# Altium project DATN.PrjPcb
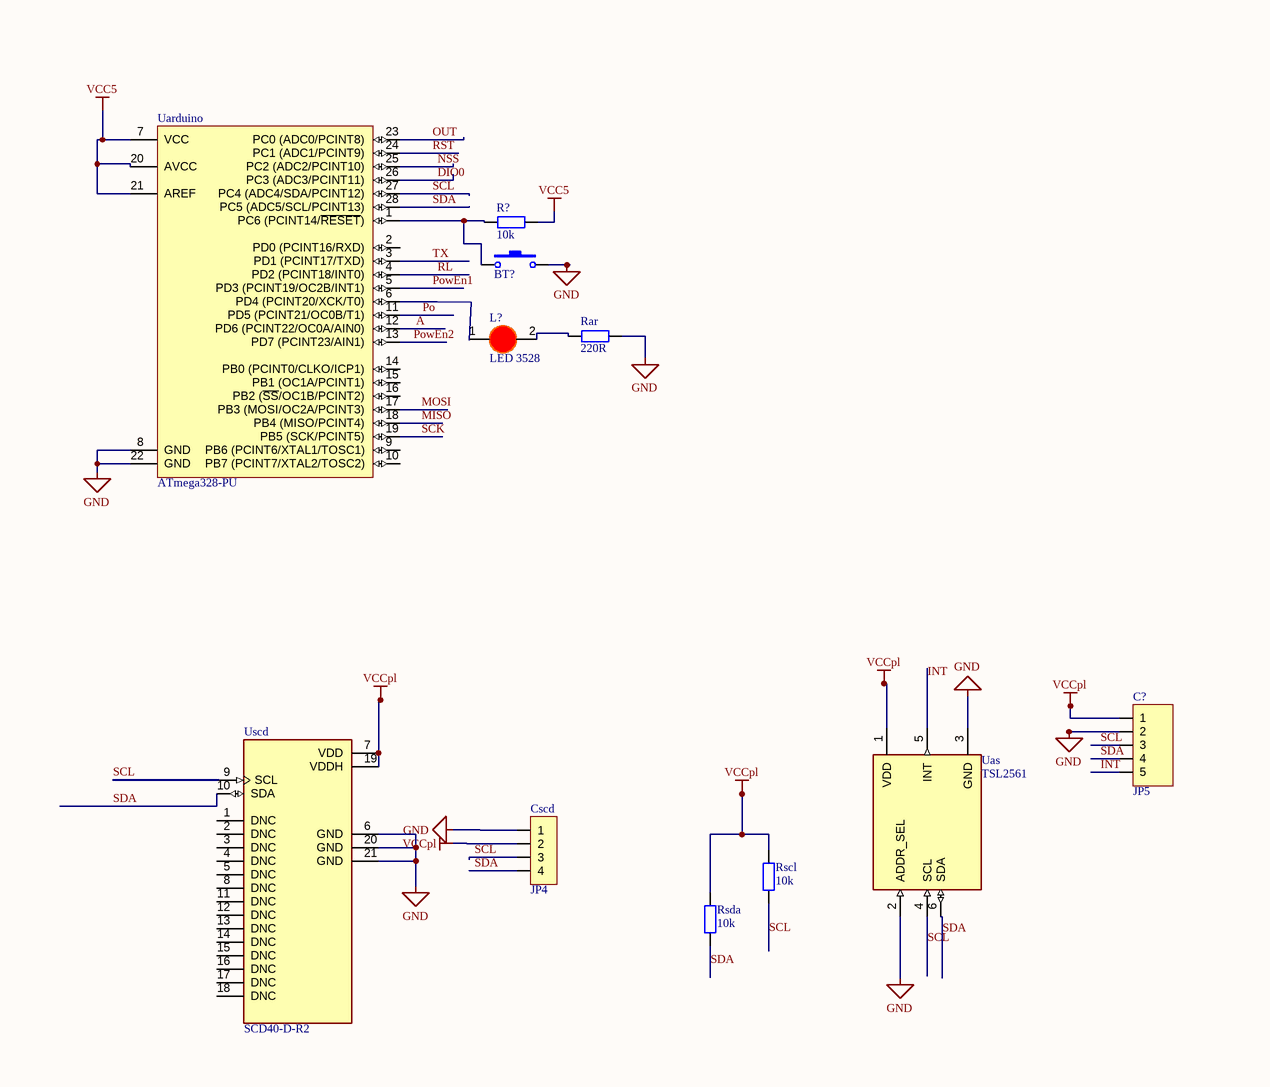
[diagram p0: Sheet1.SchDoc, top left]
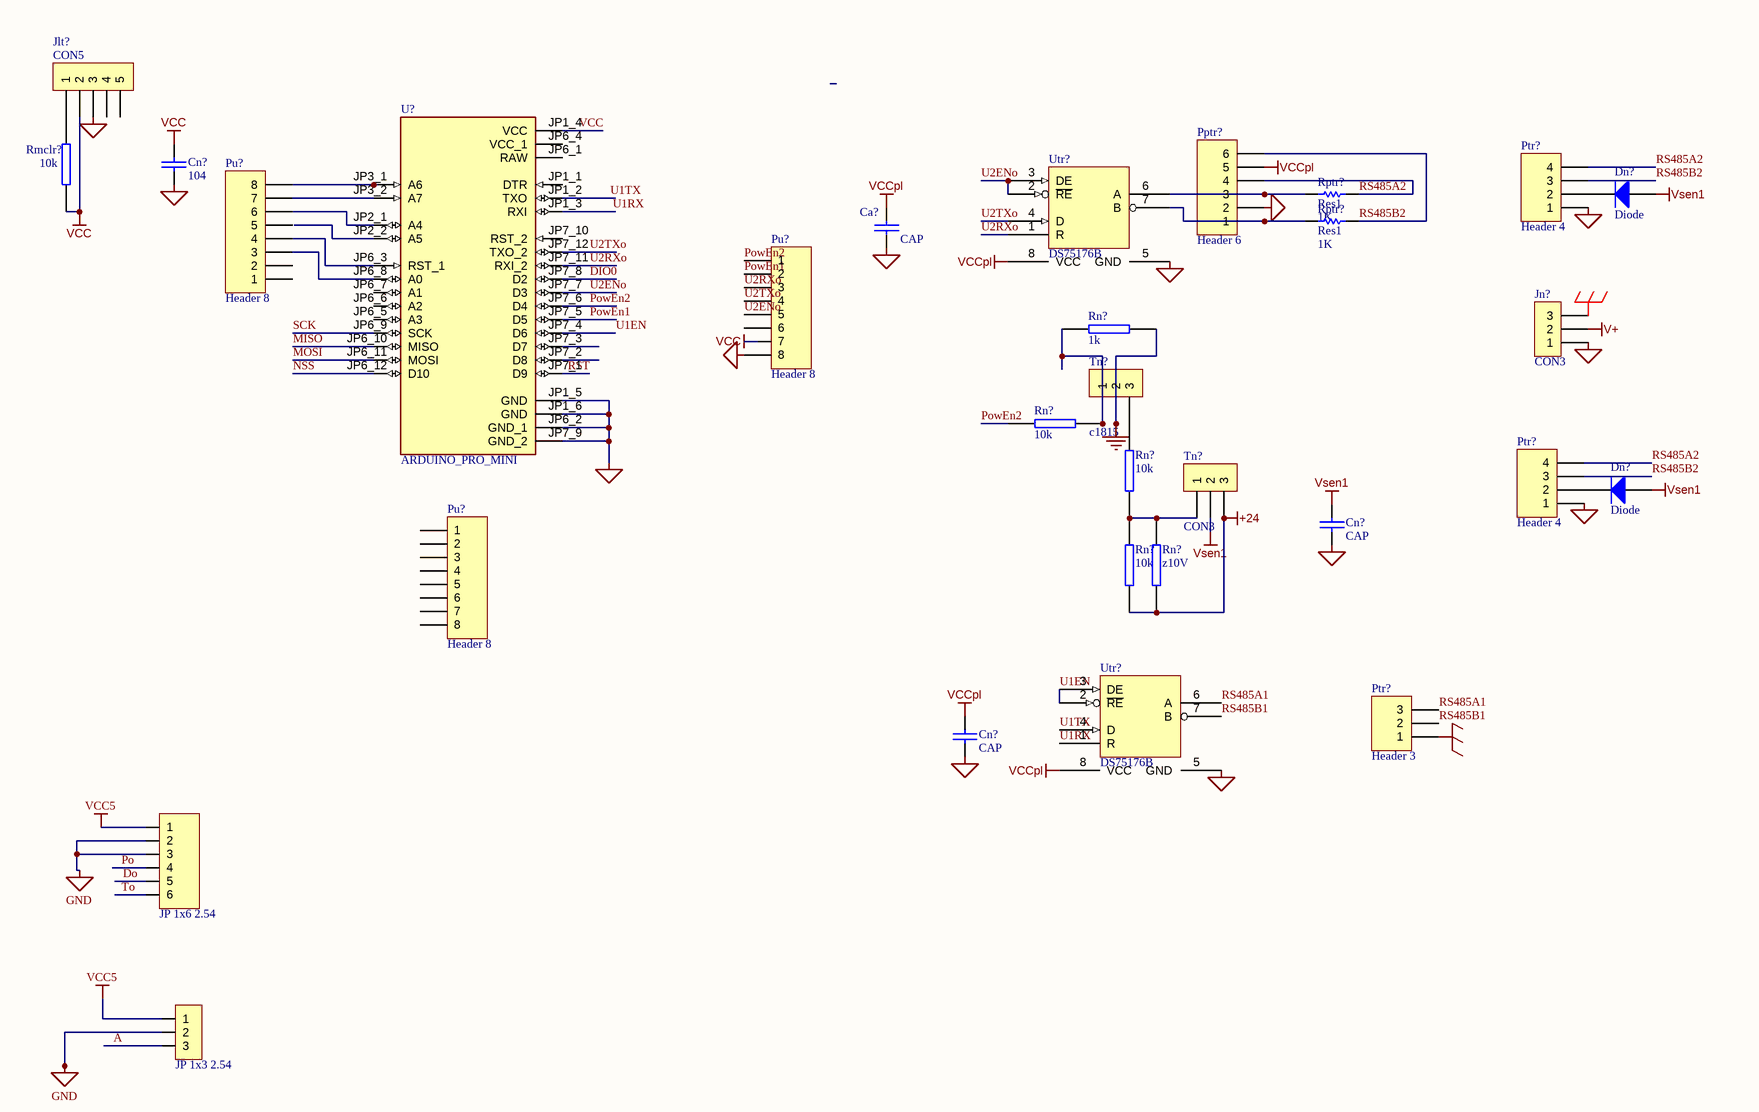
[diagram p1: Sheet1.SchDoc, top right]
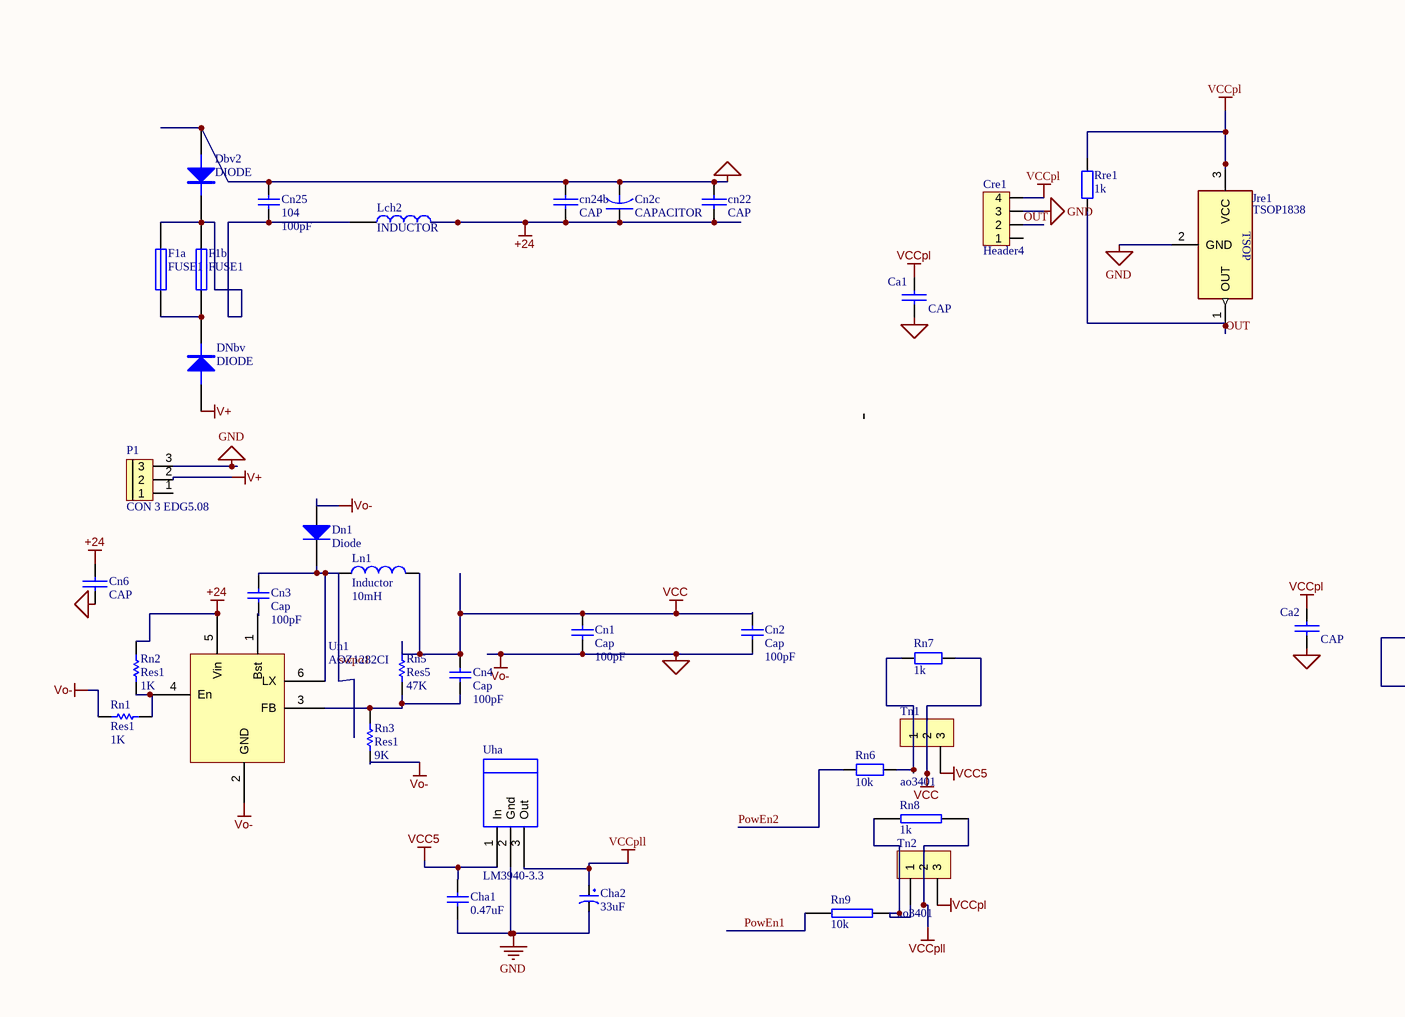
[diagram p2: Sheet1.SchDoc, bottom left]
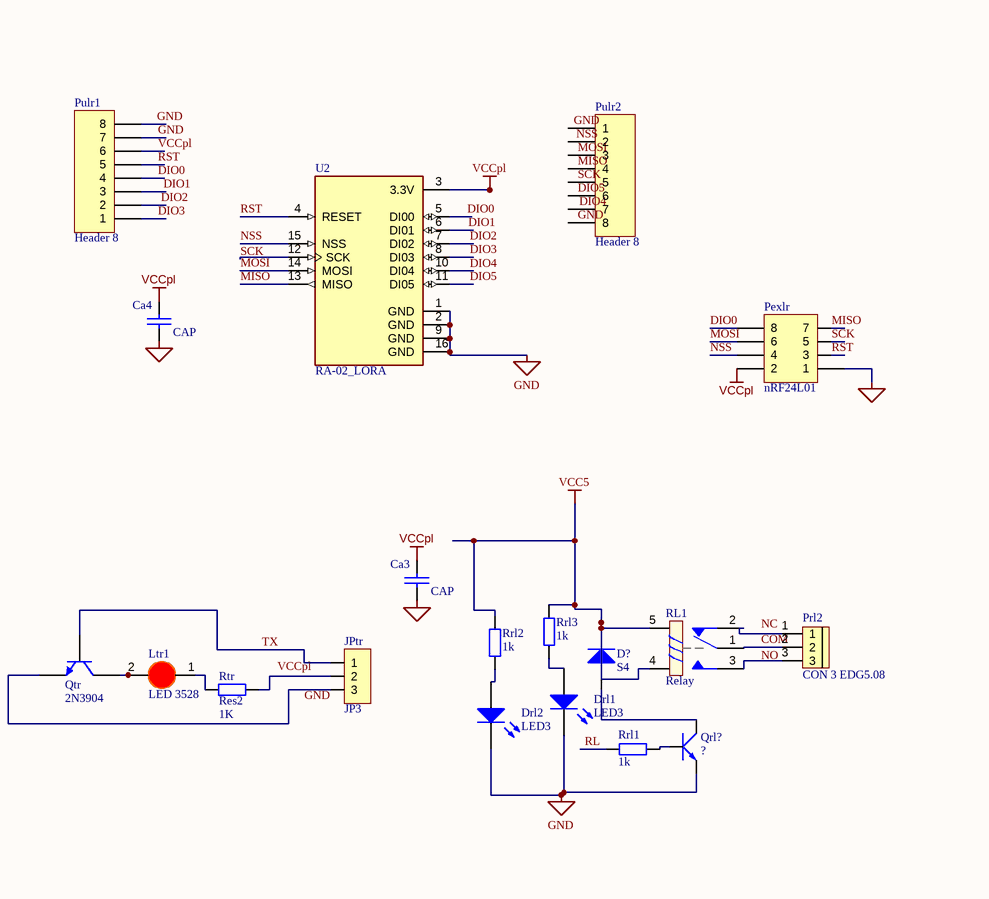
[diagram p3: Sheet1.SchDoc, bottom right]
1 sheet, 96 parts. Net scope: global (net labels, ports and power ports of the same name join across sheets).
Board file: PCB1.PcbDoc

## Sheet Sheet1.SchDoc
size 594 x 420 mm; SheetNumber: 1; SheetTotal: 1; SPICEModelCacheKOELNJHK: <root> / <DocumentId>KOELNJHK</DocumentId> / <CacheFrame Number="0"> / <Model Name="diode" Kind="MDL"> / <Text>*Default Diode / *Diode Pinout: A,K / .MODEL DIODE D()</Text> / </Model> / </CacheFrame> / </root>

### Parts
(Parts that share a designator on the sheet are numbered #1, #2 ... from top to bottom, then left to right.)
BT?  Nut Nhan 2 Chan SMD 3x6x2.5  [Nut Nhan 2 Chan SMD 3x6x2.5]  (value not drawn)
C?  JP5  [JP5-C1T]
Ca1  CAP  [0805]
Ca2  CAP  [0805]
Ca3  CAP  [0805]
Ca4  CAP  [0805]
Ca?  CAP  [0805]
Cha1  0.47uF  [tu tantalum dip5.08]
Cha2  33uF  [tu tantalum smd3216]
Cn1  Cap  value 100pF  [RAD-0.3]
Cn2  Cap  value 100pF  [RAD-0.3]
Cn2c  CAPACITOR  [cc15r15]
Cn3  Cap  value 100pF  [RAD-0.3]
Cn4  Cap  value 100pF  [RAD-0.3]
Cn6  CAP  [1206e]
cn22  CAP  [C4006]
cn24b  CAP  [1206e]
Cn25  104  value 100pF  [0805c]
Cn?#1  104  [0805]
Cn?#2  CAP  [1206e]
Cn?#3  CAP  [0805]
Cre1  Header4  [HDR4]
Cscd  JP4  [JP4-C1T]
D?  S4  [DIODE SOD-123]
Dbv2  DIODE  [smb]
Dn1  Diode  [SMC]
Dn?#1  Diode  [Sma]
Dn?#2  Diode  [Sma]
DNbv  DIODE  [sma]
Drl1  LED3  [3.5X2.8X1.9]
Drl2  LED3  [3.5X2.8X1.9]
F1a  FUSE1  [2010e]
F1b  FUSE1  [FuseSMD050]
Jlt?  CON5  [sip5]
Jn?  CON3  [giacdung3]
JP?#1  JP 1x6 2.54  [JP 1x6 CT]
JP?#2  JP 1x3 2.54  [JP 1x3 DT]
JPtr  JP3  [JP3-C1T]
Jre1  TSOP1838  [TSOP1838]
L?  LED 3528  [LED-3528-RED]
Lch2  INDUCTOR  [IND_SPR05x]
Ln1  Inductor  value 10mH  [0402-A]
Ltr1  LED 3528  [LED-3528-RED]
P1  CON 3 EDG5.08  [CON 3 3EDG5.08]
Pexlr  nRF24L01  [HDR2X4]
Pptr?  Header 6  [sot23-6]
Prl2  CON 3 EDG5.08  [CON 3 3EDG5.08]
Ptr?#1  Header 4  [giacdung4]
Ptr?#2  Header 4  [giacdung4]
Ptr?#3  Header 3  [giacdung3]
Pu?#1  Header 8  [HDR1X8]
Pu?#2  Header 8  [HDR1X8]
Pu?#3  Header 8  [HDR1X8]
Pulr1  Header 8  [HDR1X8]
Pulr2  Header 8  [HDR1X8]
Qrl?  ?  [TO92]
Qtr  2N3904  [TO-92A]
R?  10k  [tro vach 2w]
Rar  220R  [tro vach 2w]
RL1  Relay  [Relay 5 Chan SRD]
Rmclr?  10k  [0805c]
Rn1  Res1  value 1K  [AXIAL-0.3]
Rn2  Res1  value 1K  [AXIAL-0.3]
Rn3  Res1  value 9K  [AXIAL-0.3]
Rn5  Res5  value 47K  [AXIAL-0.3]
Rn6  10k  [tro vach 1w]
Rn7  1k  [tro vach 2w]
Rn8  1k  [0805c]
Rn9  10k  [0805c]
Rn?#1  1k  [0805c]
Rn?#2  10k  [0805c]
Rn?#3  10k  [0805c]
Rn?#4  10k  [0805c]
Rn?#5  z10V  [1206]
Rptr?#1  Res1  value 1K  [0805c]
Rptr?#2  Res1  value 1K  [0805c]
Rre1  1k  [tro vach 2w]
Rrl1  1k  [tro vach 2w]
Rrl2  1k  [tro vach 2w]
Rrl3  1k  [tro vach 2w]
Rscl  10k  [tro smd 2512]
Rsda  10k  [tro smd 2512]
Rtr  Res2  value 1K  [AXIAL-0.4]
Tn1  ao3401  [sot23-3]
Tn2  ao3401  [sot23-3]
Tn?#1  c1815  [sot23-3]
Tn?#2  CON3  [dpak]
U2  RA-02_LORA  [MODULE_RA-02_LORA]
U?  ARDUINO_PRO_MINI  [MODULE_ARDUINO_PRO_MINI]
Uarduino  ATmega328-PU  [DIP28]
Uas  TSL2561  [XDCR_TSL2561]
Uha  LM3940-3.3  [SOT223]
Un1  AOZ1282CI  [Sot23-6]
Uscd  SCD40-D-R2  [XDCR_SCD40-D-R2]
Utr?#1  DS75176B  [so-8]
Utr?#2  DS75176B  [so-8]

### Nets
+24: Cn2c.1 Cn6.1 cn22.1 cn24b.1 Lch2.2 Rn2.2 Rn?#4.1 Rn?#5.1 Tn?#2.3 Un1.5(Vin)
EARTH: Jn?.3 Ptr?#3.1
GND: BT?.2 C?.2 Ca1.2 Ca2.2 Ca3.2 Ca4.2 Ca?.2 Cha1.2 Cha2.2 Cn1.1 Cn2.1 Cn2c.2 Cn6.2 cn22.2 cn24b.2 Cn25.2 Cn?#1.2 Cn?#2.2 Cn?#3.2 Cre1.3 Cscd.1 Dbv2.1(A) Dn1.1(A) Drl1.2(K) Drl2.2(K) Jlt?.3 Jn?.1 JP?#1.2 JP?#1.3 JP?#2.2 Jre1.2(GND) P1.3 Pexlr.1 Pptr?.2 Ptr?#1.1 Ptr?#2.1 Pu?#1.8 Pulr1.7 Pulr1.8 Qrl?.1(E) Rar.2 Rn1.1 Rn3.1 Rn?#1.2 Tn?#1.2 U2.1(GND) U2.2(GND) U2.9(GND) U2.16(GND) U?.JP1_5(GND) U?.JP1_6(GND) U?.JP6_2(GND_1) U?.JP7_9(GND_2) Uarduino.8(GND) Uarduino.22(GND) Uas.2(ADDR_SEL) Uas.3(GND) Uha.2(Gnd) Un1.2(GND) Uscd.6(GND) Uscd.20(GND) Uscd.21(GND) Utr?#1.5(GND) Utr?#2.5(GND)  [also labelled Vo-]
V+: DNbv.1(A) Jn?.2 P1.2
VCC: C?.1 Ca1.1 Ca2.1 Ca3.1 Ca4.1 Ca?.1 Cn1.2 Cn2.2 Cn4.2 Cn?#1.1 Cn?#3.1 Cre1.4 Cscd.2 Jlt?.2 Jre1.3(VCC) Pexlr.2 Pptr?.5 Pu?#1.7 Pulr1.6 Rmclr?.1 Rn5.2 Rn7.2 Rre1.2 Rscl.2 Rsda.2 Tn1.2 Tn2.3 U2.3(3.3V) U?.JP1_4(VCC) Uas.1(VDD) Uscd.7(VDD) Uscd.19(VDDH) Utr?#1.8(VCC) Utr?#2.8(VCC)  [also labelled VCCpl]
VCC5: Cha1.1 D?.2(K) JP?#1.1 JP?#2.1 R?.2 RL1.4 RL1.5 Rrl2.2 Rrl3.2 Tn1.3 Uarduino.7(VCC) Uarduino.20(AVCC) Uarduino.21(AREF) Uha.1(In)
VCCpll: Cha2.1 Rn8.2 Tn2.2 Uha.3(Out)
Vsen1: Cn?#2.1 Dn?#1.1(A) Dn?#2.1(A) Tn?#2.2
A: JP?#2.3 Uarduino.12(PD6_(PCINT22/OC0A/AIN0))
COM: Prl2.2 RL1.1
DIO0: Pexlr.8 Pulr1.4 U2.5(DI00) U?.JP7_8(D2) Uarduino.26(PC3_(ADC3/PCINT11))
DIO1: Pulr1.3 U2.6(DI01)
DIO2: Pulr1.2 U2.7(DI02)
DIO3: Pulr1.1 U2.8(DI03)
DIO4: U2.10(DI04)
DIO5: U2.11(DI05)
Do: JP?#1.5
INT: C?.5 Uas.5(INT)
MISO: Pexlr.7 U2.13(MISO) U?.JP6_10(MISO) Uarduino.18(PB4_(MISO/PCINT4))
MOSI: Pexlr.6 U2.14(MOSI) U?.JP6_11(MOSI) Uarduino.17(PB3_(MOSI/OC2A/PCINT3))
NSS: Pexlr.4 U2.15(NSS) U?.JP6_12(D10) Uarduino.25(PC2_(ADC2/PCINT10))
OUT: Cre1.2 Jre1.1(OUT) Rre1.1 Uarduino.23(PC0_(ADC0/PCINT8))
Po: JP?#1.4 Uarduino.11(PD5_(PCINT21/OC0B/T1))
PowEn1: Pu?#1.2 Rn9.1 U?.JP7_5(D5) Uarduino.5(PD3_(PCINT19/OC2B/INT1))
PowEn2: Pu?#1.1 Rn6.1 Rn?#2.1 U?.JP7_6(D4) Uarduino.13(PD7_(PCINT23/AIN1))
RL: Rrl1.1 Uarduino.4(PD2_(PCINT18/INT0))
RS485A1: Ptr?#3.3 Utr?#2.6(A)
RS485A2: Pptr?.4 Ptr?#1.4 Ptr?#2.4 Rptr?#1.1
RS485B1: Ptr?#3.2 Utr?#2.7(B)
RS485B2: Pptr?.6 Ptr?#1.3 Ptr?#2.3 Rptr?#2.1
RST: Pexlr.3 Pulr1.5 U2.4(RESET) U?.JP7_1(D9) Uarduino.24(PC1_(ADC1/PCINT9))
SCK: Pexlr.5 U2.12(SCK) U?.JP6_9(SCK) Uarduino.19(PB5_(SCK/PCINT5))
SCL: C?.3 Cscd.3 Rscl.1 Uarduino.27(PC4_(ADC4/SDA/PCINT12)) Uas.4(SCL) Uscd.9(SCL)
SDA: C?.4 Cscd.4 Rsda.1 Uarduino.28(PC5_(ADC5/SCL/PCINT13)) Uas.6(SDA) Uscd.10(SDA)
swpo1: Cn3.2 Dn1.2(K) Ln1.1 Un1.6(LX)
To: JP?#1.6
TX: JPtr.1 Qtr.2(B) Uarduino.3(PD1_(PCINT17/TXD))
U1EN: U?.JP7_4(D6) Utr?#2.2(~{RE}) Utr?#2.3(DE)
U1RX: U?.JP1_3(RXI) Utr?#2.1(R)
U1TX: U?.JP1_2(TXO) Utr?#2.4(D)
U2ENo: Pu?#1.5 U?.JP7_7(D3) Utr?#1.2(~{RE}) Utr?#1.3(DE)
U2RXo: Pu?#1.3 U?.JP7_11(RXI_2) Utr?#1.1(R)
U2TXo: Pu?#1.4 U?.JP7_12(TXO_2) Utr?#1.4(D)
NetBT?_1: BT?.1 R?.1 Uarduino.1(PC6_(PCINT14/~{RESET}))
NetCn3_1: Cn3.1 Un1.1(Bst)
NetCn4_1: Cn4.1 Rn3.2 Rn5.1 Un1.3(FB)
NetCn25_1: Cn25.1 Dbv2.2(K) F1a.2 F1b.2 Lch2.1
NetD?_1: D?.1(A) Qrl?.3(C)
NetDn?#1_2: Dn?#1.2(K) Ptr?#1.2
NetDn?#2_2: Dn?#2.2(K) Ptr?#2.2
NetDNbv_2: DNbv.2(K) F1a.1 F1b.1
NetDrl1_1: Drl1.1(A) Rrl3.1
NetDrl2_1: Drl2.1(A) Rrl2.1
NetJlt?_1: Jlt?.1 Rmclr?.2
NetJPtr_2: JPtr.2 Rtr.2
NetJPtr_3: JPtr.3 Qtr.1(E)
NetL?_1: L?.1(A) Uarduino.6(PD4_(PCINT20/XCK/T0))
NetL?_2: L?.2(K) Rar.1
NetLtr1_1: Ltr1.1(A) Rtr.1
NetLtr1_2: Ltr1.2(K) Qtr.3(C)
NetPptr?_1: Pptr?.1 Rptr?#2.2 Utr?#1.7(B)
NetPptr?_3: Pptr?.3 Rptr?#1.2 Utr?#1.6(A)
NetPrl2_1: Prl2.1 RL1.2
NetPrl2_3: Prl2.3 RL1.3
NetPu?#2_3: Pu?#2.3 U?.JP6_8(A0)
NetPu?#2_4: Pu?#2.4 U?.JP6_3(RST_1)
NetPu?#2_6: Pu?#2.6 U?.JP2_1(A4)
NetPu?#2_7: Pu?#2.7 U?.JP3_2(A7)
NetPu?#2_8: Pu?#2.8 U?.JP3_1(A6)
NetQrl?_2: Qrl?.2(B) Rrl1.2
NetRn1_2: Rn1.2 Rn2.1 Un1.4(En)
NetRn6_2: Rn6.2 Rn7.1 Tn1.1
NetRn8_1: Rn8.1 Rn9.2 Tn2.1
NetRn?#1_1: Rn?#1.1 Rn?#2.2 Tn?#1.1
NetRn?#3_1: Rn?#3.1 Tn?#1.3
NetRn?#3_2: Rn?#3.2 Rn?#4.2 Rn?#5.2 Tn?#2.1

Not connected (* = marked no-connect by the designer): Cre1 1; Jlt? 4 5; Ln1 2; P1 1; Pu?#1 6; Pu?#2 1 2 5; Pu?#3 1 2 3 4 5 6 7 8; Pulr2 1 2 3 4 5 6 7 8; U? JP1_1(DTR) JP2_2(A5) JP6_1(RAW) JP6_4(VCC_1) JP6_5(A3) JP6_6(A2) JP6_7(A1) JP7_2(D8) JP7_3(D7) JP7_10(RST_2); Uarduino 2(PD0_(PCINT16/RXD)) 9(PB6_(PCINT6/XTAL1/TOSC1)) 10(PB7_(PCINT7/XTAL2/TOSC2)) 14(PB0_(PCINT0/CLKO/ICP1)) 15(PB1_(OC1A/PCINT1)) 16(PB2_(~{SS}/OC1B/PCINT2)); Uscd 1(DNC) 2(DNC) 3(DNC) 4(DNC) 5(DNC) 8(DNC) 11(DNC) 12(DNC) 13(DNC) 14(DNC) 15(DNC) 16(DNC) 17(DNC) 18(DNC)

### Notes on the sheet
- Labels drawn without touching a wire or pin: DIO5, GND, MISO, MOSI, NC, NO, NSS, SCK, VCCpl
- DWG NO:
- REV:
- THIS DOCUMENT AND THE DATA DISCLOSED HEREIN OR
- HEREWITH IS THE PROPERTY OF ALTIUM LIMITED AND MAY
- BE FREELY DISTRIBUTED IN WHOLE. NO RIGHTS ARE
- RESERVED OR EXPRESS OR IMPLIED WARANTEE GIVEN.
- REVISION
- DESCRIPTION
- DATE
- APPROVED
- ENG:
- APPROVALS
- PROJECT
- DSN:
- CHK:
- REFERENCE DOCUMENTS
- PROJECT REVISION:
- TITLE
- DOCUMENT REVISION:
- DESIGN ITEM:
- BOM:
- FAB DWG:
- PCB DWG:
- ASSY DWG:
- SCALE:
- A2
- SIZE
- CAGE CODE
- FILE NAME
- DWG NO.
- SHEET
- OF
- REV
- (in symbol TSOP1838) TSOP

### Library data of the parts
BT? = Nut Nhan 2 Chan SMD 3x6x2.5: Ma_Hang: MH001036; Ten: Nút Nhấn 2 Chân 3x6x2.5MM SMD
C? = JP5: WR-PHD 2.54 mm Angled Socket Header; Manufacturer: W¨¹rth Elektronik eiSos GmbH; partNo: 613005143121; ComponentLink1 Description: Manufacturer; ComponentLink2 Description: Datasheet; NoPins: 05; Created Date: 29 March 2013; ComponentLink1URL: http://www.we-online.com; ComponentLink2URL: http://katalog.we-online.de/em/datasheet/6130xx143121.pdf; Created by: Karrer Zheng
Ca1-Ca4 Ca? Cn6 cn22 cn24b Cn?#1-Cn?#3 = CAP: Capacitor
Cha1 = Tu tantalum 0.47uF 50V DIP5.08: Cắm; Don_Vi: Con; So_Chan: 2; Ten_Linh_Kien: Tụ tantalum 0.47uF 474 50V 5.08mm (sứ vàng); Ma_Hang: MH007469; Chung_Loai: Cắm; Kieu_Chan: *
Cha2 = Tu tantalum 33uF 6.3V SMD3216: Dán; Don_Vi: Con; So_Chan: 2; Ten_Linh_Kien: Tụ tantalum J336-33uF 6.3V SMD3216; Ma_Hang: MH008674; Chung_Loai: Dán; Kieu_Chan: *
Cn1-Cn4 Cn25 = Cap: Capacitor; Published: 8-Jun-2000; LatestRevisionDate: 17-Jul-2002; LatestRevisionNote: Re-released for DXP Platform.; PackageReference: RAD-0.3; Publisher: Altium Limited
  Cn1-Cn4: PackageDescription: Radial Cap, Thru-Hole; 2 Leads; 0.3 in Pin Spacing
Cre1 = Header4: Header IDC, 4 x 1 Pin Vertical 2.54mm Pitch (Non-Boxed, Male); Manufacturer: W¨¹rth Elektronik eiSos GmbH; partNo: 613002143121; ComponentLink1 Description: Manufacturer; ComponentLink2 Description: Datasheet; NoPins: 02; Created Date: 29 March 2013; ComponentLink1URL: http://www.we-online.com; ComponentLink2URL: http://katalog.we-online.de/em/datasheet/6130xx143121.pdf; Created by: Karrer Zheng
Cscd = JP4: WR-PHD 2.54 mm Angled Socket Header; Manufacturer: W¨¹rth Elektronik eiSos GmbH; partNo: 613004143121; ComponentLink1 Description: Manufacturer; ComponentLink2 Description: Datasheet; NoPins: 04; Created Date: 29 March 2013; ComponentLink1URL: http://www.we-online.com; ComponentLink2URL: http://katalog.we-online.de/em/datasheet/6130xx143121.pdf; Created by: Karrer Zheng
D? = Diode S4: Dán; Ten_Linh_Kien: Diode S4 SOD123 ( 1N5819 SOD123); Ma_Hang: MH005519; Don_Vi: Con; Ghi_Chu: *; Chung_Loai: Dán; Kieu_Chan: *
Dn1 Dn?#1 Dn?#2 = Diode: Default Diode; Published: 8-Jun-2000; LatestRevisionDate: 17-Jul-2002; LatestRevisionNote: Re-released for DXP Platform.; PackageVersion: Sep-1996; PackageReference: SMC; Publisher: Altium Limited; Code_JEDEC: DO-214-AB
  Dn1: PackageDescription: DO-214-AB/SMC; 2 C-Bend Leads; Body 7.9 x 5.9 mm, inc. leads (LxW)
Drl1 Drl2 = LED3: Typical BLUE SiC LED; Published: 8-Jun-2000; LatestRevisionDate: 17-Dec-2003; LatestRevisionNote: PCB Footprint replaced.; DatasheetVersion: 16-Apr-2002; PackageVersion: 16-Apr-2002; PackageReference: 3.5X2.8X1.9; Publisher: Altium Limited; PackageDescription: SM LED; 2 C-Bend Leads; Body 3.5 x 2.8 x 1.9 mm, inc leads (LxWxH typ)
F1a F1b = FUSE1: Fuse
Jlt? = CON5: Connector
Jn? Tn1 Tn2 Tn?#1 Tn?#2 = CON3: Connector
JP?#1 = JP 1x6 2.54 Cai Thang: Cắm; Ten_Linh_Kien: Jump Đơn Cái 2.54MM 1x20P Thẳng; Don_Vi: Con; Ma_Hang: MH004006; Ghi_Chu: *; Kieu_Chan: *; Chung_Loai: Cắm
JP?#2 = JP 1x3 2.54 Duc Thang: Cắm; Ten_Linh_Kien: Jump Đơn Đực 2.54MM 1x40P Thẳng 11MM; Don_Vi: Con; Ma_Hang: MH000903; Ghi_Chu: *; Kieu_Chan: *; Chung_Loai: Cắm
JPtr = JP3: WR-PHD 2.54 mm Angled Socket Header; Manufacturer: W¨¹rth Elektronik eiSos GmbH; partNo: 613003143121; ComponentLink1 Description: Manufacturer; ComponentLink2 Description: Datasheet; NoPins: 03; Created Date: 29 March 2013; ComponentLink1URL: http://www.we-online.com; ComponentLink2URL: http://katalog.we-online.de/em/datasheet/6130xx143121.pdf; Created by: Karrer Zheng
Jre1 = TSOP1838: IR Remote Receiver 38KHz 35m 3-Pin; MF: Vishay; SnapEDA_Link: https://www.snapeda.com/parts/TSOP1838/Vishay/view-part/?ref=snap; Package: None; Value: *; MP: TSOP1838; Check_prices: https://www.snapeda.com/parts/TSOP1838/Vishay/view-part/?ref=eda
L? Ltr1 = LED 3528 Do: Dán; Don_Vi: Con; Ma_Hang: MH005543; Ten_Linh_Kien: LED3528 Màu Đỏ; Ghi_Chu: *; Kieu_Chan: *; Chung_Loai: Dán
Ln1 = Inductor: Code_IEC: 1005; Published: 8-Jun-2000; LatestRevisionDate: 29-May-2009; LatestRevisionNote: IPC-7351 Footprint Added.; PackageReference: 0402-A; Publisher: Altium Limited; PackageDescription: Chip Inductor; Code_JEITA: 0402
P1 Prl2 = CON 3 EDG5.08: Cắm; Ten_Linh_Kien: CON 3 2EDG5.08-3P 5.08MM ( Xanh Cong); Ma_Hang: MH000760; Ghi_Chu: *; Kieu_Chan: *; Don_Vi: Con; Chung_Loai: Cắm
Pexlr = Header 4X2: Header, 4-Pin, Dual row; LatestRevisionDate: 17-Jul-2002; LatestRevisionNote: Re-released for DXP Platform.; Publisher: Altium Limited
Pptr? = Header 6: Header, 6-Pin; LatestRevisionDate: 17-Jul-2002; LatestRevisionNote: Re-released for DXP Platform.; Publisher: Altium Limited
Ptr?#1 Ptr?#2 = Header 4: Header, 4-Pin; LatestRevisionDate: 17-Jul-2002; LatestRevisionNote: Re-released for DXP Platform.; Publisher: Altium Limited
Ptr?#3 = Header 3: Header, 3-Pin; LatestRevisionDate: 17-Jul-2002; LatestRevisionNote: Re-released for DXP Platform.; Publisher: Altium Limited
Pu?#1-Pu?#3 Pulr1 Pulr2 = Header 8: Header, 8-Pin; LatestRevisionDate: 17-Jul-2002; LatestRevisionNote: Re-released for DXP Platform.; Publisher: Altium Limited
Qrl? = Trans 2N3904: NPN transistor EBC; Value: C9014
Qtr = 2N3904: NPN General Purpose Amplifier; Published: 8-Jun-2000; LatestRevisionDate: 15-Jan-2003; LatestRevisionNote: PCB Footprint 'BCY-W3/D4.7' replaced; DatasheetVersion: 1997; PackageVersion: Sep-1998; PackageReference: TO-92A; Publisher: Altium Limited; PackageDescription: TO, Flat Index; 3 In-Line, Axial Leads; Body Dia. 4.5mm; Leads 0.51 x 0.48 mm (max); ComponentLink1Description: Manufacturer Link; ComponentLink1URL: http://www.fairchildsemi.com/; ComponentLink2Description: Datasheet; ComponentLink2URL: http://www.fairchildsemi.com/ds/2N%2F2N3904.pdf
R? = Tro Vach 2W 5% 10k: Cắm; Don_Vi: Con; So_Chan: 2; Ten_Linh_Kien: Trở 5% 2w 10k; Ma_Hang: MH006358; Chung_Loai: Cắm; Kieu_Chan: *
Rar = Tro Vach 2W 5% 220R: Cắm; So_Chan: 2; Don_Vi: Con; Ten_Linh_Kien: Trở 5% 2w 220R; Ma_Hang: MH006383; Chung_Loai: Cắm; Kieu_Chan: *
RL1 = Relay 5 Chan SRD: Relay 5 Chan; Ma_Hang: MH009374; Ten: Relay 5V10A SRD-05VDC-SL-C Chính Hãng
Rmclr? Rn8 Rn9 Rn?#1-Rn?#5 = RES2
Rn1-Rn3 Rn5 Rptr?#1 Rptr?#2 = Res1: Resistor; Published: 8-Jun-2000; LatestRevisionDate: 17-Jul-2002; LatestRevisionNote: Re-released for DXP Platform.; PackageReference: AXIAL-0.3; Publisher: Altium Limited
  Rn1-Rn3 Rn5: PackageDescription: Axial Device, Thru-Hole; 2 Leads; 0.3 in Pin Spacing
Rn6 = Tro Vach 1W 5% 10k: Cắm; Don_Vi: Con; So_Chan: 2; Ten_Linh_Kien: Trở 5% 1w 10k; Ma_Hang: MH006391; Chung_Loai: Cắm; Kieu_Chan: *
Rn7 Rre1 Rrl1-Rrl3 = Tro Vach 2W 5% 1k: Cắm; Don_Vi: Con; So_Chan: 2; Ten_Linh_Kien: Trở 5% 2w 1k; Ma_Hang: MH006364; Chung_Loai: Cắm; Kieu_Chan: *
Rscl Rsda = Tro 2512 5% 10k: Dán; Don_Vi: Con; Ten_Linh_Kien: Trở 2512 5% 103-10k 1W; So_Chan: 2; Ma_Hang: MH003439; Chung_Loai: Dán; Kieu_Chan: *
Rtr = Res2: Resistor; Published: 8-Jun-2000; LatestRevisionDate: 17-Jul-2002; LatestRevisionNote: Re-released for DXP Platform.; PackageReference: AXIAL-0.4; Publisher: Altium Limited; PackageDescription: Axial Device, Thru-Hole; 2 Leads; 0.4 in Pin Spacing
U2 = RA-02_LORA: Ra-02 LoRa RF M5Stack Platform Evaluation Expansion Board; Price: None; Availability: Unavailable; MP: RA-02_LORA; Value: *; Package: None
U? = ARDUINO_PRO_MINI: This board was developed for applications and installations where space is premium and projects are made as permanent set ups. Small, available in 3.3 V and 5 V versions, powered by ATmega328P.; MP: Arduino Pro Mini; SnapEDA_Link: https://www.snapeda.com/parts/Arduino%20Pro%20Mini/Arduino/view-part/?ref=snap; Package: None; Value: *; MF: Arduino; Check_prices: https://www.snapeda.com/parts/Arduino%20Pro%20Mini/Arduino/view-part/?ref=eda
Uarduino = ATmega328-PU: 8-bit AVR Microcontroller, 32KB Flash, 1KB EEPROM, 2KB SRAM, 28-pin PDIP, Industrial Grade (-40°C to 85°C); Published: 1-Apr-2010; DatasheetVersion: revA, Jan-2010; PackageVersion: revB, Sep-2001; PackageReference: 28P3; Publisher: Altium Limited; PackageDescription: 28-lead (0.300"/7.62mm Wide) Plastic Dual Inline Package (PDIP); Supplier 1: Digi-Key; Supplier Part Number 1: ATMEGA328-PU-ND; Supplier 2: Mouser; Supplier Part Number 2: 556-ATMEGA328-PU; ComponentLink1Description: Manufacturer Link; ComponentLink1URL: http://www.atmel.com/products/avr/default.asp?; ComponentLink2Description: ATmega48A/48PA/88A/88PA/168A/168PA/328/328P Datasheet; ComponentLink2URL: http://www.atmel.com/dyn/resources/prod_documents/8271.pdf; ComponentLink3Description: ATmega48A/48PA/88A/88PA/168A/168PA/328/328P Summary; ComponentLink3URL: http://www.atmel.com/dyn/resources/prod_documents/8271S.pdf; ComponentLink4Description: Atmel.com Home; ComponentLink4URL: http://www.atmel.com
Uas = TSL2561: Optical Sensor Ambient 640nm IÂ²C 6-SMD, No Lead; MF: ams; SnapEDA_Link: https://www.snapeda.com/parts/TSL2561/ams/view-part/?ref=snap; Package: SMD-6 TAOS; Value: *; MP: TSL2561; Check_prices: https://www.snapeda.com/parts/TSL2561/ams/view-part/?ref=eda
Uha = LM3940-3.3-SOT223: 3.3 VOLT LINEAR REGULATOR SOT223; Manufacturer: National Semiconductor; Manufacturer Part Number: LM3940IMP-3.3/NOPB; Number of Regulators: 1; Regulator Topology: Positive Fixed; Voltage - Output: 3.3V; Current - Output: 1A; Voltage - Input: 4.5 ~ 5.5 V; Voltage - Dropout (Typical): 0.11V @ 100mA; Supplier 1: Digi-Key; Supplier Part Number 1: LM3940IMP-3.3DKR-ND; Package / Case: SOT-223 (3 leads + Tab), SC-73, TO-261AA; Operating Temperature: -40°C ~ 125°C; Supplier Part Number: LM3940IMP-3.3DKR-ND; Supplier: Digi-Key; Current - Limit (Min): -; Packaging: Digi-Reel®; RoHS: RoHS Compliant; Category: Integrated Circuits (ICs)
Un1 = AOZ1282CI: AOZ1282
Uscd = SCD40-D-R2: Air Quality Sensor CO2 Sensor 2.5V/3.3V/5V 20-Pin SMD EP; MF: Sensirion AG; SnapEDA_Link: https://www.snapeda.com/parts/SCD40-D-R2/Sensirion+AG/view-part/?ref=snap; Package: None; Value: *; MP: SCD40-D-R2; Check_prices: https://www.snapeda.com/parts/SCD40-D-R2/Sensirion+AG/view-part/?ref=eda
Utr?#1 Utr?#2 = DS36F95: DIFFERENTIAL BUS TRANSCEIVERS